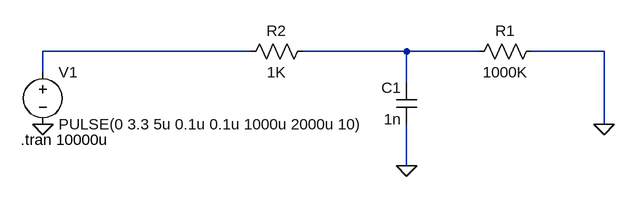
[diagram p0: schematic EntkoppelTest.asc]
EntkoppelTest.asc, the LTspice schematic file:
Version 4
SHEET 1 880 680
WIRE -16 160 -336 160
WIRE 224 160 64 160
WIRE 336 160 224 160
WIRE 528 160 416 160
WIRE -336 192 -336 160
WIRE 224 208 224 160
WIRE 528 272 528 160
WIRE 224 336 224 272
FLAG -336 272 0
FLAG 528 272 0
FLAG 224 336 0
SYMBOL cap 240 272 R180
WINDOW 0 24 56 Left 2
WINDOW 3 24 8 Left 2
SYMATTR InstName C1
SYMATTR Value 1n
SYMATTR SpiceLine V=50 Irms=83.8m Rser=2.70485 Lser=0 mfg="KEMET" pn="C0805C102K5RAC" type="X7R"
SYMBOL res 432 144 R90
WINDOW 0 0 56 VBottom 2
WINDOW 3 32 56 VTop 2
SYMATTR InstName R1
SYMATTR Value 1000K
SYMATTR SpiceLine tol=1 pwr=0.1
SYMBOL voltage -336 176 R0
WINDOW 123 0 0 Left 2
WINDOW 39 0 0 Left 2
SYMATTR InstName V1
SYMATTR Value PULSE(0 3.3 5u 0.1u 0.1u 1000u 2000u 10)
SYMBOL res 80 144 R90
WINDOW 0 0 56 VBottom 2
WINDOW 3 32 56 VTop 2
SYMATTR InstName R2
SYMATTR Value 1K
SYMATTR SpiceLine tol=1 pwr=0.1
TEXT -370 296 Left 2 !.tran 10000u

The netlist it stands for:
* EntkoppelTest.asc
C1 0 N002 1n V=50 Irms=83.8m Rser=2.70485 Lser=0 mfg="KEMET" pn="C0805C102K5RAC" type="X7R"
R1 0 N002 1000K tol=1 pwr=0.1
V1 N001 0 PULSE(0 3.3 5u 0.1u 0.1u 1000u 2000u 10)
R2 N002 N001 1K tol=1 pwr=0.1
.tran 10000u
.backanno
.end